# Altium schematic sheet EMG_new.SchDoc
size A4; SheetNumber: 2; SheetTotal: 2
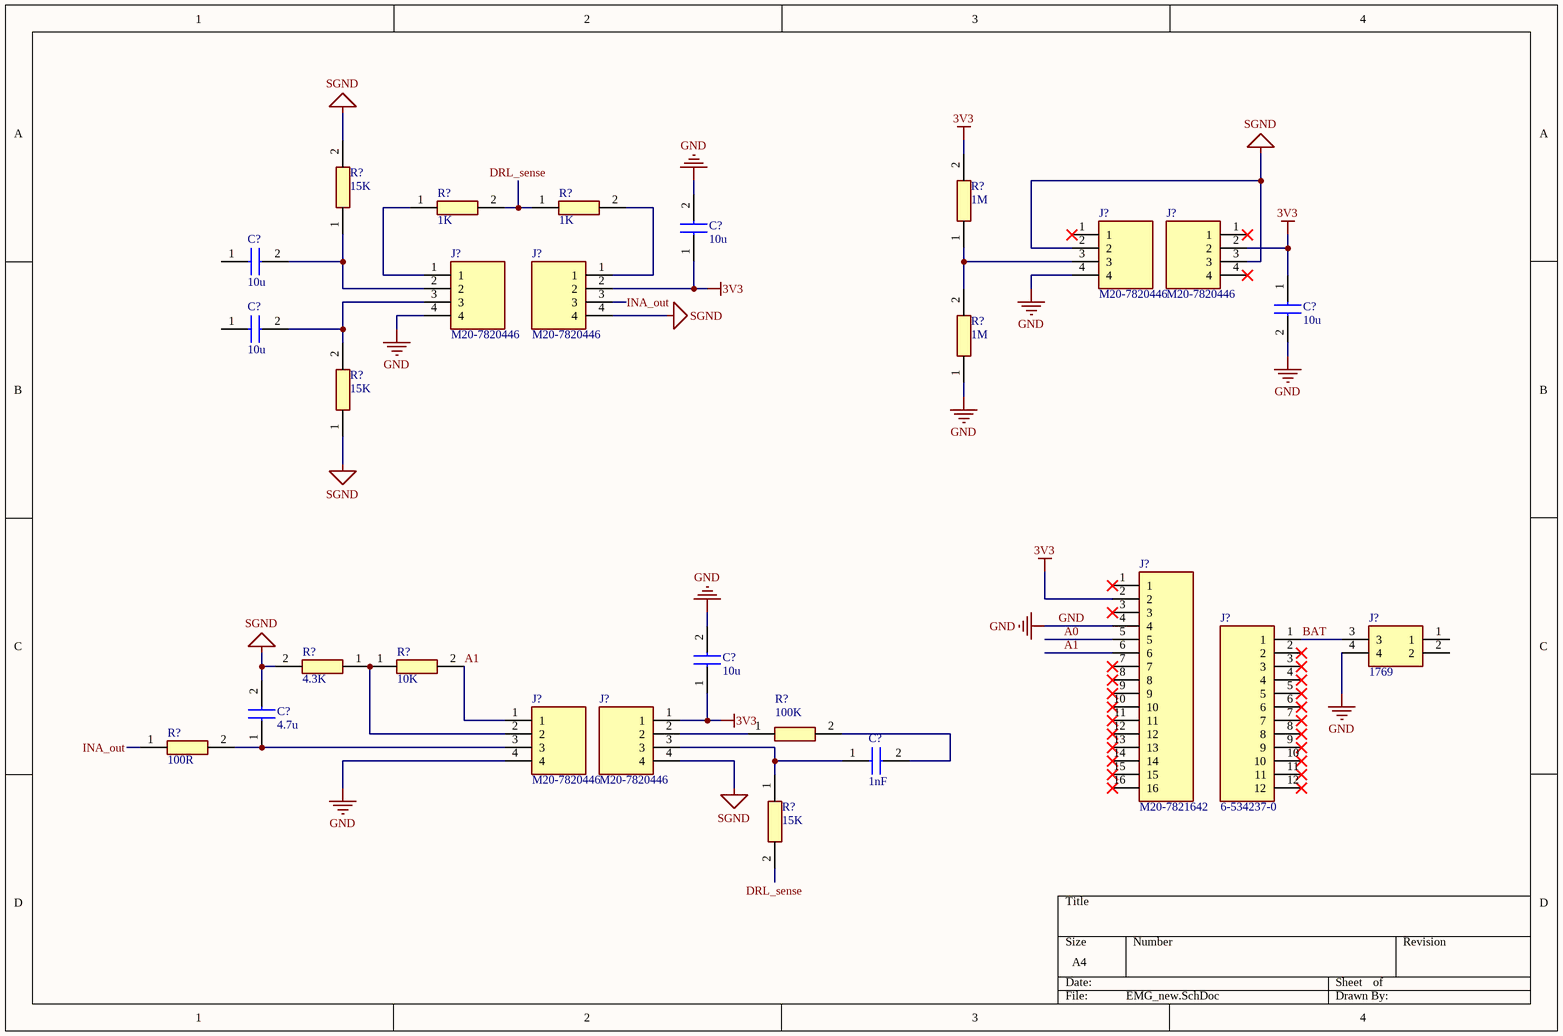
[diagram p0: EMG_new.SchDoc]

## Parts
(Parts that share a designator on the sheet are numbered #1, #2 ... from top to bottom, then left to right.)
C?#1  10u  [CAPC2012X135N]
C?#2  10u  [CAPC2012X135N]
C?#3  10u  [CAPC2012X135N]
C?#4  10u  [CAPC2012X135N]
C?#5  10u  [CAPC2012X135N]
C?#6  4.7u  [CAPC2114X145N]
C?#7  1nF  [CAPC2012X140N]
J?#1  M20-7820446  [RHDR4W70P0X254_1X4_1056X250X865P]
J?#2  M20-7820446  [RHDR4W70P0X254_1X4_1056X250X865P]
J?#3  M20-7820446  [RHDR4W70P0X254_1X4_1056X250X865P]
J?#4  M20-7820446  [RHDR4W70P0X254_1X4_1056X250X865P]
J?#5  M20-7821642  [RHDR16W70P0X254_1X16_4104X250X865P]
J?#6  6-534237-0  [RHDR12W76P0X254_1X12_3048X356X889P]
J?#7  1769  [1769]
J?#8  M20-7820446  [RHDR4W70P0X254_1X4_1056X250X865P]
J?#9  M20-7820446  [RHDR4W70P0X254_1X4_1056X250X865P]
R?#1  1K  [RESC2012X60N]
R?#2  1K  [RESC2012X60N]
R?#3  15K  [RESC2013X84N]
R?#4  1M  [ERJUP6]
R?#5  1M  [ERJUP6]
R?#6  15K  [RESC2013X84N]
R?#7  10K  [ERJUP6]
R?#8  4.3K  [ERJUP6]
R?#9  100K  [ERJUP6]
R?#10  100R  [RESC2012X70N]
R?#11  15K  [ERJP06D1000V]

## Nets
3V3: C?#2.1 C?#3.1 C?#5.1 J?#2.2 J?#4.2 J?#5.2 J?#9.1 R?#4.2
GND: C?#2.2 C?#3.2 C?#5.2 J?#1.4 J?#3.4 J?#5.4 J?#7.4 J?#8.4 R?#5.1
SGND: C?#6.2 J?#1.2 J?#2.3 J?#4.4 J?#9.4 R?#3.2 R?#6.1 R?#8.2
A0: J?#5.5
A1: J?#5.6 J?#8.1 R?#7.2
BAT: J?#6.1 J?#7.3
DRL_sense: R?#1.2 R?#2.1 R?#11.2
INA_out: J?#4.3 R?#10.1
NetC?#1_2: C?#1.2 J?#3.2 R?#3.1
NetC?#4_2: C?#4.2 J?#3.3 R?#6.2
NetC?#6_1: C?#6.1 J?#8.3 R?#10.2
NetC?#7_1: C?#7.1 J?#9.3 R?#11.1
NetC?#7_2: C?#7.2 R?#9.2
NetJ?#1_3: J?#1.3 R?#4.1 R?#5.2
NetJ?#3_1: J?#3.1 R?#1.1
NetJ?#4_1: J?#4.1 R?#2.2
NetJ?#8_2: J?#8.2 R?#7.1 R?#8.1
NetJ?#9_2: J?#9.2 R?#9.1

Not connected (* = marked no-connect by the designer): C?#1 1; C?#4 1; J?#1 1*; J?#2 1* 4*; J?#5 1* 3* 7* 8* 9* 10* 11* 12* 13* 14* 15* 16*; J?#6 2* 3* 4* 5* 6* 7* 8* 9* 10* 11* 12*; J?#7 1 2

## Library data of the parts
C?#1-C?#5 = EMK212BB7106KG-T: Capacitor; Manufacturer_Name: TAIYO YUDEN; Datasheet Link: https://www.mouser.com/ds/2/396/mlcc11_hq_e-541564.pdf; Height: 1.35mm; Manufacturer_Part_Number: EMK212BB7106KG-T; Mouser Part Number: 963-EMK212BB7106KG-T; Mouser Price/Stock: https://www.mouser.co.uk/ProductDetail/TAIYO-YUDEN/EMK212BB7106KG-T?qs=vF%252B8ahGVilemLVRka0hELA%3D%3D
C?#6 = MCASE21GBC7475KTCA01: Capacitor; Manufacturer_Name: TAIYO YUDEN; Datasheet Link: https://www.mouser.com/datasheet/2/396/TAIYO_YUDEN_03_04_2025_MCASE21GBC7475KTCA01_SS-3571538.pdf; Height: 1.45mm; Manufacturer_Part_Number: MCASE21GBC7475KTCA01
C?#7 = C0805X102MBRAC3316: Capacitor; Manufacturer_Name: KEMET; Datasheet Link: https://search.kemet.com/component-documentation/download/specsheet/C0805X102MBRAC3316; Height: 1.4mm; Manufacturer_Part_Number: C0805X102MBRAC3316; Mouser Part Number: 80-C0805X102MBR3316; Mouser Price/Stock: https://www.mouser.co.uk/ProductDetail/KEMET/C0805X102MBRAC3316?qs=1Kr7Jg1SGW%252B2hGpng33iKA%3D%3D
J?#1-J?#4 J?#8 J?#9 = M20-7820446: Connector; Manufacturer_Name: Harwin; Datasheet Link: https://cdn.harwin.com/pdfs/M20-782.pdf; Height: 8.65mm; Manufacturer_Part_Number: M20-7820446; Mouser Part Number: 855-M20-7820446; Mouser Price/Stock: https://www.mouser.co.uk/ProductDetail/Harwin/M20-7820446?qs=vF78I%252BjhbY8%252Bno0H8mp9XA%3D%3D
J?#5 = M20-7821642: Connector; Manufacturer_Name: Harwin; Datasheet Link: https://cdn.harwin.com/pdfs/M20-782.pdf; Height: 8.65mm; Manufacturer_Part_Number: M20-7821642; Mouser Part Number: 855-M20-7821642; Mouser Price/Stock: https://www.mouser.co.uk/ProductDetail/Harwin/M20-7821642?qs=ulE8k0yEMYYHOwsI6S7TGA%3D%3D
J?#6 = 6-534237-0: Connector; Manufacturer_Name: TE Connectivity; Datasheet Link: https://www.te.com/commerce/DocumentDelivery/DDEController?Action=showdoc&DocId=Customer+Drawing%7F534237%7FS%7Fpdf%7FEnglish%7FENG_CD_534237_S.pdf%7F6-534237-0; Height: 8.89mm; Manufacturer_Part_Number: 6-534237-0; Mouser Part Number: 571-6-534237-0; Mouser Price/Stock: https://www.mouser.co.uk/ProductDetail/TE-Connectivity/6-534237-0?qs=xDp7PGUNC%252Bvx2FE8QjMJDg%3D%3D; Arrow Part Number: 6-534237-0; Arrow Price/Stock: https://www.arrow.com/en/products/6-534237-0/te-connectivity?region=nac
J?#7 = 1769: Connector; Manufacturer_Name: Adafruit; Datasheet Link: https://cdn-shop.adafruit.com/datasheets/17311.pdf; Height: 5.5mm; Manufacturer_Part_Number: 1769; Mouser Part Number: 485-1769; Mouser Price/Stock: https://www.mouser.co.uk/ProductDetail/Adafruit/1769?qs=GURawfaeGuBbgoGtf2XstA%3D%3D; Arrow Part Number: 1769; Arrow Price/Stock: https://www.arrow.com/en/products/1769/adafruit-industries?utm_currency=USD&region=nac
R?#1 R?#2 = CRCW08051K00FKTAHP: Resistor; Manufacturer_Name: Vishay; Datasheet Link: https://componentsearchengine.com/Datasheets/1/CRCW08051R00FKEAHP.pdf; Height: 0.6mm; Manufacturer_Part_Number: CRCW08051K00FKTAHP
R?#3 R?#6 = PLTT0805Z1502QGT5: Resistor; Manufacturer_Name: Vishay; Datasheet Link: https://www.vishay.com/docs/60082/pltt.pdf; Height: 0.838mm; Manufacturer_Part_Number: PLTT0805Z1502QGT5; Mouser Part Number: 71-PLTT0805Z1502QGT5; Mouser Price/Stock: https://www.mouser.co.uk/ProductDetail/Vishay-Thin-Film/PLTT0805Z1502QGT5?qs=QmnkJ35t3fjZaQs5uMld%252Bg%3D%3D
R?#4 R?#5 = ERJ-UP6D1004V: Resistor; Manufacturer_Name: Panasonic; Datasheet Link: https://industrial.panasonic.com/cdbs/www-data/pdf/RDP0000/AOA0000C337.pdf; Height: 0.7mm; Manufacturer_Part_Number: ERJ-UP6D1004V
R?#7 = ERJ-UP6D1002V: Resistor; Manufacturer_Name: Panasonic; Datasheet Link: https://industrial.panasonic.com/cdbs/www-data/pdf/RDP0000/AOA0000C337.pdf; Height: 0.7mm; Manufacturer_Part_Number: ERJ-UP6D1002V
R?#8 = ERJ-UP6D4301V: Resistor; Manufacturer_Name: Panasonic; Datasheet Link: https://industrial.panasonic.com/cdbs/www-data/pdf/RDP0000/AOA0000C337.pdf; Height: 0.7mm; Manufacturer_Part_Number: ERJ-UP6D4301V; Mouser Part Number: 667-ERJ-UP6D4301V; Mouser Price/Stock: https://www.mouser.co.uk/ProductDetail/Panasonic/ERJ-UP6D4301V?qs=ZcfC38r4PouG4jhBxte63A%3D%3D; Arrow Part Number: ERJ-UP6D4301V; Arrow Price/Stock: https://www.arrow.com/en/products/erj-up6d4301v/panasonic?region=nac
R?#9 = ERJ-UP6D1003V: Resistor; Manufacturer_Name: Panasonic; Datasheet Link: https://industrial.panasonic.com/cdbs/www-data/pdf/RDP0000/AOA0000C337.pdf; Height: 0.7mm; Manufacturer_Part_Number: ERJ-UP6D1003V
R?#10 = ERJ-S06J101V: Resistor; Manufacturer_Name: Panasonic; Datasheet Link: https://industrial.panasonic.com/cdbs/www-data/pdf/RDP0000/AOA0000C334.pdf; Height: 0.7mm; Manufacturer_Part_Number: ERJ-S06J101V; Mouser Part Number: 667-ERJ-S06J101V; Mouser Price/Stock: https://www.mouser.co.uk/ProductDetail/Panasonic/ERJ-S06J101V?qs=Zyl8A9hlmJqshrwxn1wW6g%3D%3D
R?#11 = ERJ-P06D1502V: Resistor; Manufacturer_Name: Panasonic; Datasheet Link: http://industrial.panasonic.com/cdbs/www-data/pdf/RDA0000/AOA0000C102.pdf; Height: 0.7mm; Manufacturer_Part_Number: ERJ-P06D1502V; Mouser Part Number: 667-ERJ-P06D1502V; Mouser Price/Stock: https://www.mouser.com/Search/Refine.aspx?Keyword=667-ERJ-P06D1502V